# Altium schematic sheet CIRCUIT DIAGRAM.SchDoc
size A3; Date: 11/11/2025; Author: Hung Le; Revision: v1; SheetNumber: 3; SheetTotal: 3; Size: A3
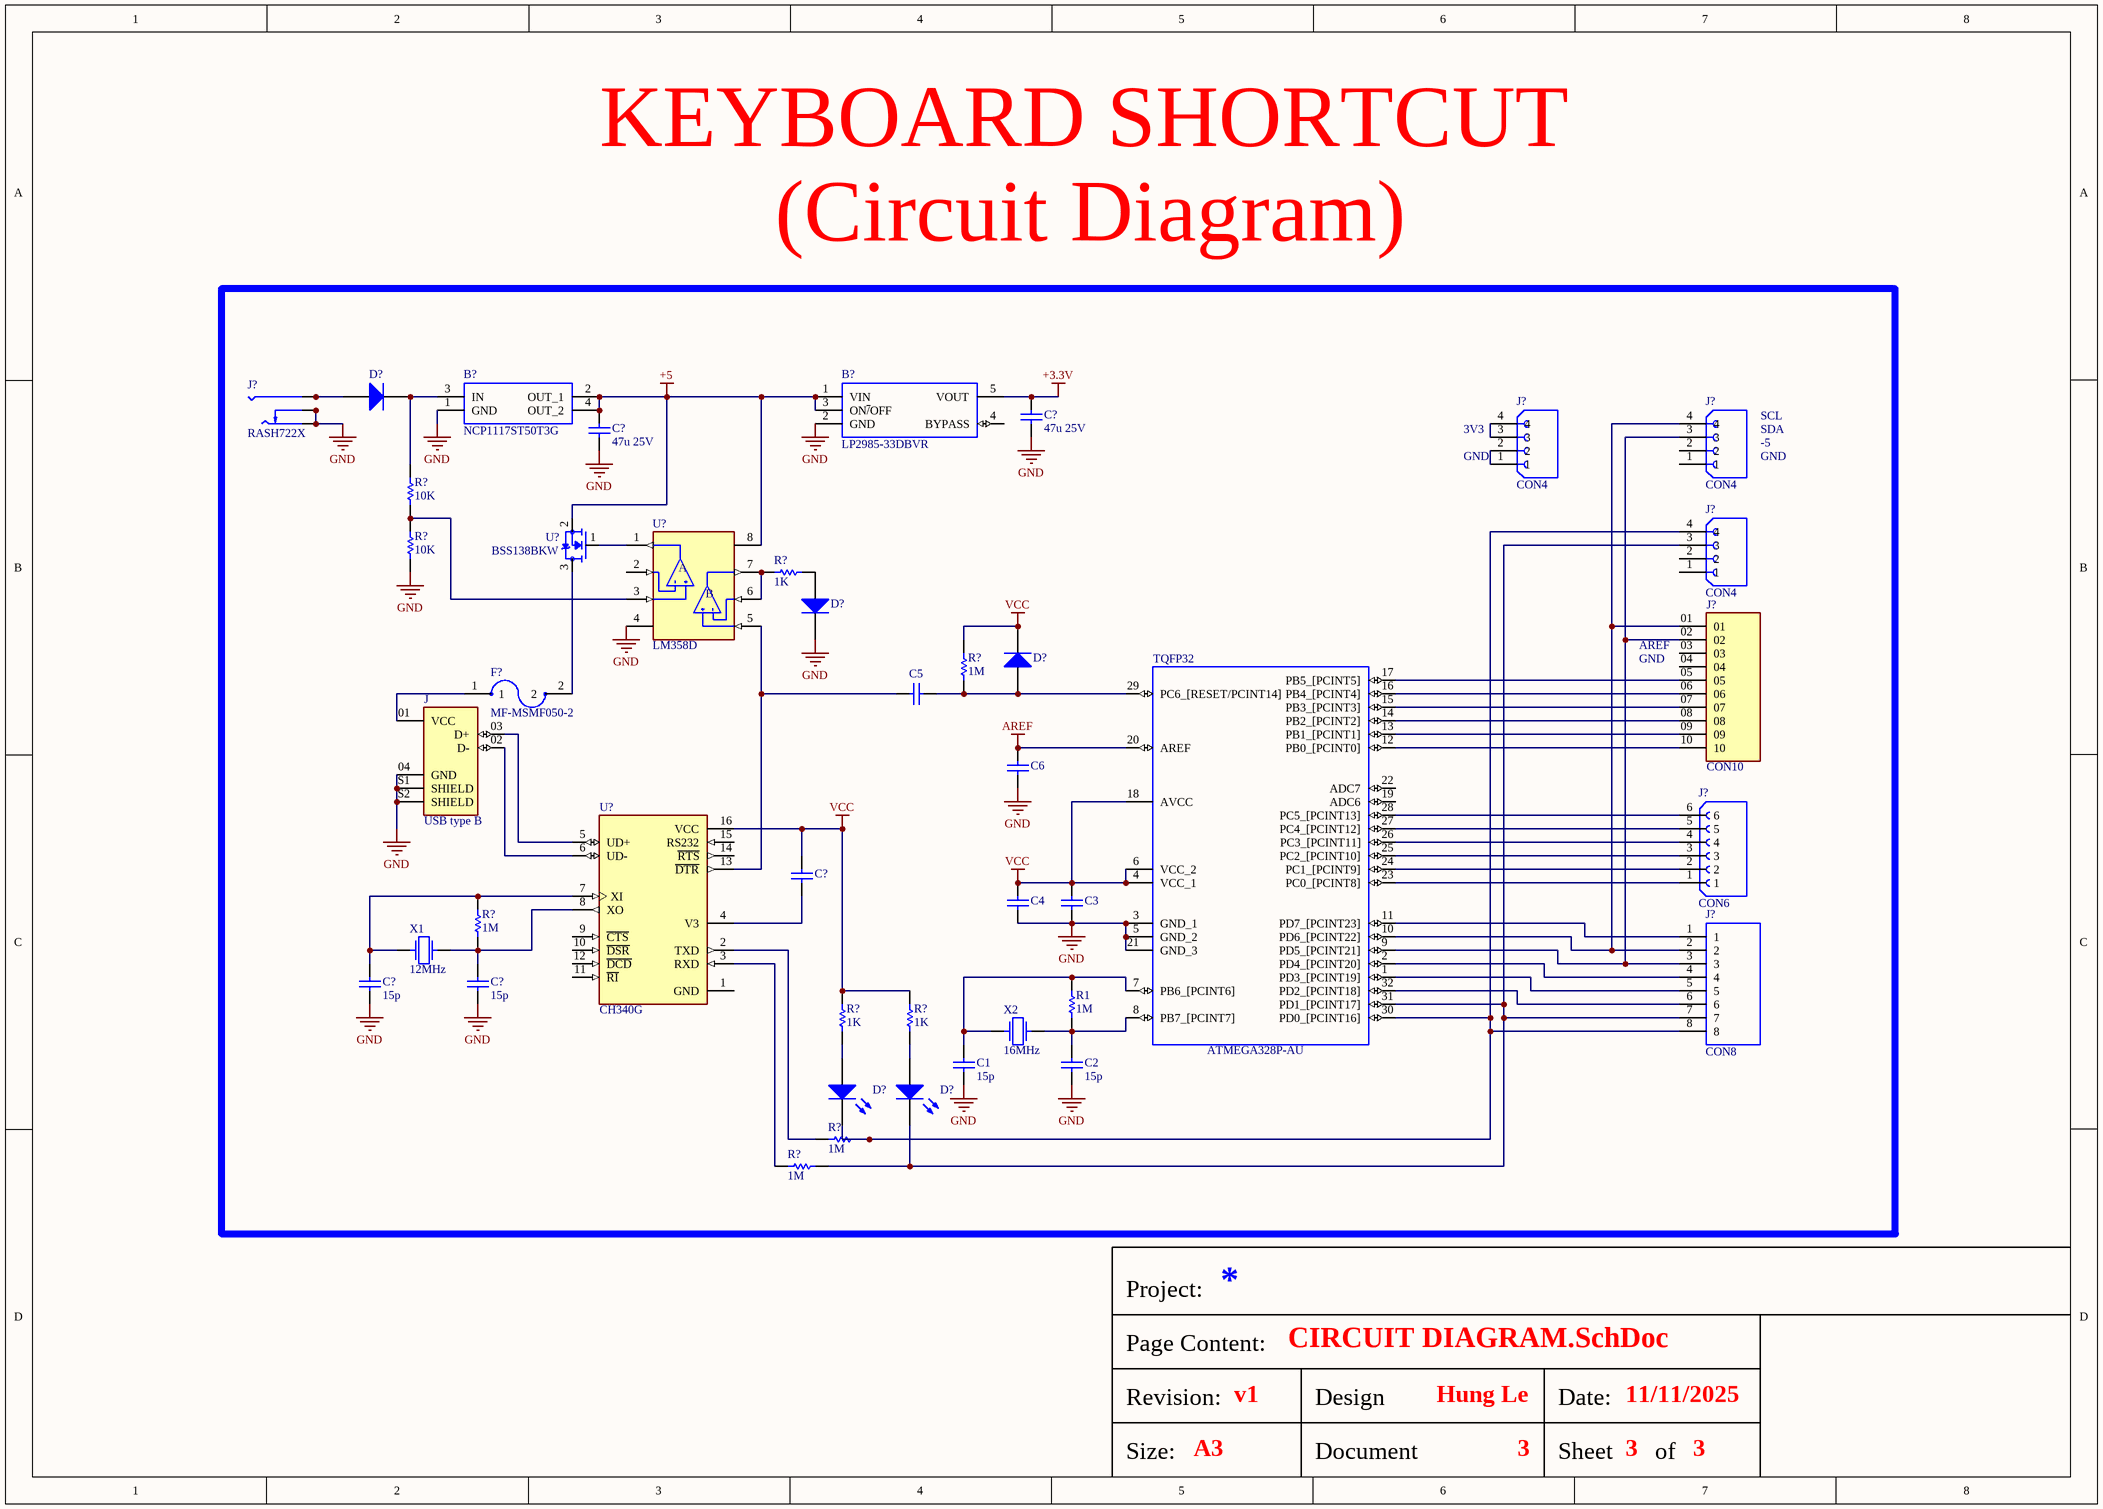
[diagram p0: CIRCUIT DIAGRAM.SchDoc]

## Parts
(Parts that share a designator on the sheet are numbered #1, #2 ... from top to bottom, then left to right.)
B?#1  LP2985-33DBVR  [SOT95P280X145-5N]
B?#2  NCP1117ST50T3G  [SOT230P700X180-4N]
C1  value 15p  (hidden comment: Capacitor)
C2  value 15p  (hidden comment: Capacitor)
C3  Capacitor  (value not drawn)
C4  Capacitor  (value not drawn)
C5  Capacitor  (value not drawn)
C6  Capacitor  (value not drawn)
C?#1  value 47u 25V  (hidden comment: Capacitor)
C?#2  value 47u 25V  (hidden comment: Capacitor)
C?#3  Capacitor  (value not drawn)
C?#4  value 15p  (hidden comment: Capacitor)
C?#5  value 15p  (hidden comment: Capacitor)
D?#1  Diode  (value not drawn)
D?#2  Diode  (value not drawn)
D?#3  Diode  (value not drawn)
D?#4  Light-Emitting Diode  (value not drawn)
D?#5  Light-Emitting Diode  (value not drawn)
F?  MF-MSMF050-2  [FUSM4632X85]
J  USB type B  [SAMTEC_USB-B-S-X-X-VT]
J?#1  RASH722X  [SWITCHCRAFT_RASH722X]
J?#2  CON4  [SULLINS_PPTC041LFBN-RC]
J?#3  CON4  [SULLINS_PPTC041LFBN-RC]
J?#4  CON4  [SULLINS_PPTC041LFBN-RC]
J?#5  CON10  [SAMTEC_SSW-110-01-XXX-S]
J?#6  CON6  [SULLINS_PPTC061LFBN-RC]
J?#7  CON8  [HDRV8W90P0X254_1X8_2032X249X560P]
R1  value 1M  (hidden comment: Resistor)
R?#1  value 10K  (hidden comment: Resistor)
R?#2  value 10K  (hidden comment: Resistor)
R?#3  value 1K  (hidden comment: Resistor)
R?#4  value 1M  (hidden comment: Resistor)
R?#5  value 1M  (hidden comment: Resistor)
R?#6  value 1K  (hidden comment: Resistor)
R?#7  value 1K  (hidden comment: Resistor)
R?#8  value 1M  (hidden comment: Resistor)
R?#9  value 1M  (hidden comment: Resistor)
TQFP32  ATMEGA328P-AU  [QFP80P900X900X120-32N]
U?#1  BSS138BKW  [SOT65P210X110-3N]
U?#2  LM358D  [SOIC127P599X175-8N]
U?#3  CH340G  [SOIC127P600X180-16N]
X1  F0: 12MHz  (hidden comment: Crystal)
X2  F0: 16MHz  (hidden comment: Crystal)

## Nets
+3.3V: B?#1.5(VOUT) C?#1.2
+5: B?#1.1(VIN) B?#1.3(ON~{/}OFF) B?#2.2(OUT_1) B?#2.4(OUT_2) C?#2.2 U?#1.2(S) U?#2.8(V+)
AREF: C6.2 TQFP32.20(AREF)
GND: B?#1.2(GND) B?#2.1(GND) C1.1 C2.1 C3.1 C4.1 C6.1 C?#1.1 C?#2.1 C?#4.1 C?#5.1 D?#2.2(K) J.04(GND) J.S1(SHIELD) J.S2(SHIELD) J?#1.SHUNT J?#1.SHUNT_2(SHUNT) J?#1.SLV(SLEEVE) J?#1.SLV_2(SLEEVE) R?#2.1 TQFP32.3(GND_1) TQFP32.5(GND_2) TQFP32.21(GND_3) U?#2.4(V-)
VCC: C3.2 C4.2 C?#3.2 D?#3.2(K) R?#4.2 R?#6.2 R?#7.2 TQFP32.4(VCC_1) TQFP32.6(VCC_2) TQFP32.18(AVCC) U?#3.16(VCC)
NetB?#2_3: B?#2.3(IN) D?#1.2(K) R?#1.2
NetC1_2: C1.2 R1.2 TQFP32.7(PB6_[PCINT6]) X2.2
NetC2_2: C2.2 R1.1 TQFP32.8(PB7_[PCINT7]) X2.1
NetC5_1: C5.1 D?#3.1(A) R?#4.1 TQFP32.29(PC6_[RESET/PCINT14])
NetC5_2: C5.2 U?#2.5(IN2+) U?#3.13(~{DTR})
NetC?#3_1: C?#3.1 U?#3.4(V3)
NetC?#4_2: C?#4.2 R?#5.2 U?#3.7(XI) X1.2
NetC?#5_2: C?#5.2 R?#5.1 U?#3.8(XO) X1.1
NetD?#1_1: D?#1.1(A) J?#1.PIN J?#1.PIN_2(PIN)
NetD?#2_1: D?#2.1(A) R?#3.1
NetD?#4_1: D?#4.1(A) R?#6.1
NetD?#4_2: D?#4.2(K) J?#4.4 J?#7.8 R?#8.1 TQFP32.30(PD0_[PCINT16])
NetD?#5_1: D?#5.1(A) R?#7.1
NetD?#5_2: D?#5.2(K) J?#4.3 J?#7.7 R?#9.1 TQFP32.31(PD1_[PCINT17])
NetF?_1: F?.1 J.01(VCC)
NetF?_2: F?.2 U?#1.3(D)
NetJ?#2_1: J?#2.1 J?#2.2
NetJ?#2_3: J?#2.3 J?#2.4
NetJ?#3_3: J?#3.3 J?#5.02 J?#7.3 TQFP32.9(PD5_[PCINT21])
NetJ?#3_4: J?#3.4 J?#5.01 J?#7.2 TQFP32.10(PD6_[PCINT22])
NetJ?#5_05: J?#5.05 TQFP32.17(PB5_[PCINT5])
NetJ?#5_06: J?#5.06 TQFP32.16(PB4_[PCINT4])
NetJ?#5_07: J?#5.07 TQFP32.15(PB3_[PCINT3])
NetJ?#5_08: J?#5.08 TQFP32.14(PB2_[PCINT2])
NetJ?#5_09: J?#5.09 TQFP32.13(PB1_[PCINT1])
NetJ?#5_10: J?#5.10 TQFP32.12(PB0_[PCINT0])
NetJ?#6_1: J?#6.1 TQFP32.23(PC0_[PCINT8])
NetJ?#6_2: J?#6.2 TQFP32.24(PC1_[PCINT9])
NetJ?#6_3: J?#6.3 TQFP32.25(PC2_[PCINT10])
NetJ?#6_4: J?#6.4 TQFP32.26(PC3_[PCINT11])
NetJ?#6_5: J?#6.5 TQFP32.27(PC4_[PCINT12])
NetJ?#6_6: J?#6.6 TQFP32.28(PC5_[PCINT13])
NetJ?#7_1: J?#7.1 TQFP32.11(PD7_[PCINT23])
NetJ?#7_4: J?#7.4 TQFP32.2(PD4_[PCINT20])
NetJ?#7_5: J?#7.5 TQFP32.1(PD3_[PCINT19])
NetJ?#7_6: J?#7.6 TQFP32.32(PD2_[PCINT18])
NetJ_02: J.02(D-) U?#3.6(UD-)
NetJ_03: J.03(D+) U?#3.5(UD+)
NetR?#1_1: R?#1.1 R?#2.2 U?#2.3(IN1+)
NetR?#3_2: R?#3.2 U?#2.6(IN2-) U?#2.7(OUT2)
NetR?#8_2: R?#8.2 U?#3.2(TXD)
NetR?#9_2: R?#9.2 U?#3.3(RXD)
NetU?#1_1: U?#1.1(G) U?#2.1(OUT1)

Not connected (* = marked no-connect by the designer): B?#1 4(BYPASS); J?#3 1 2; J?#4 1 2; J?#5 03 04; TQFP32 19(ADC6) 22(ADC7); U?#2 2(IN1-); U?#3 1(GND) 9(~{CTS}) 10(~{DSR}) 11(~{RI}) 12(~{DCD}) 14(~{RTS}) 15(RS232)

## Notes on the sheet
- KEYBOARD SHORTCUT
- (Circuit Diagram)
- ARDUINO UNO SMD CH340
- (near J?#2) 3V3
- SCL
- SDA
- -5
- (near J?#2) GND
- GND
- (near J?#5) AREF
- (near J?#5) GND
- Project:
- Page Content:
- Revision:
- Size:
- Design by:
- Document number:
- Date:
- Sheet       of
- (in symbol LM358D) A; B

## Library data of the parts
B?#1 = LP2985-33DBVR: 150-mA Low-noise Low-dropout Regulator With Shutdown; Manufacturer_Name: Texas Instruments; Geometry.Height: 1.45mm; Manufacturer_Part_Number: LP2985-33DBVR; RS Part Number: *; RS Price/Stock: *; Mouser Part Number: 595-LP2985-33DBVR; Mouser Price/Stock: https://www.mouser.com/Search/Refine.aspx?Keyword=595-LP2985-33DBVR; Datasheet Link: http://www.ti.com/lit/gpn/lp2985
B?#2 = NCP1117ST50T3G: ON SEMICONDUCTOR - NCP1117ST50T3G - LDO, REG, 20VIN, 1A, 5V, 1%, SOT223-3; Allied_Number: 70466898; Geometry.Height: 1.8mm; Manufacturer_Name: ON Semiconductor; Manufacturer_Part_Number: NCP1117ST50T3G; RS Part Number: 8022130P; RS Price/Stock: http://uk.rs-online.com/web/p/products/8022130P; Allied Price/Stock: http://www.alliedelec.com/on-semiconductor-ncp1117st50t3g/70466898/; Mouser Part Number: 863-NCP1117ST50T3G; Mouser Price/Stock: https://www.mouser.com/Search/Refine.aspx?Keyword=863-NCP1117ST50T3G; Datasheet Link: http://www.onsemi.com/pub/Collateral/NCP1117-D.PDF
C1 C2 C?#1 C?#2 C?#4 C?#5 = Capacitor: SimulationGenericComponent: True
C3-C6 C?#3 = Capacitor: SimulationGenericComponent: True; Value: 1p
D?#1-D?#3 = Diode: AF: 1; BV: 0; BV_MAX: 1e99; EG: 1.11; FC: 0.5; IBV: 0.001; ISR: 1e-14; MJSW: 0.33; NTUN: 30; TNOM: 27; XTI: 3; SimulationGenericComponent: True; CJO: 0; CJP: 0; CTA: 0; CTP: 0; FCS: 0.5; FV_MAX: 1e99; IKF: 0; IKR: 0; JSW: 0; JTUN: 0; JTUNSW: 0; KEG: 1; KF: 0; LEVEL: 1; N: 1; NBV: 1; NR: 1; NS: 1; PHP: 1; RS: 0; TCV: 0; TLEV: 0; TLEVC: 0; TM1: 0; TM2: 0; TPB: 0; TPHP: 0; TRS: 0; TRS2: 0; TT: 0; TTT1: 0; TTT2: 0; VJ: 1; XTITUN: 3; IS: 1e-14
D?#4 D?#5 = LED: AF: 1; BV: 0; BV_MAX: 1e99; EG: 1.11; FC: 0.5; IBV: 0.001; IS: 1e-14; MJSW: 0.33; NTUN: 30; TNOM: 27; XTI: 3; SimulationGenericComponent: True; CJO: 0; CJP: 0; CTA: 0; CTP: 0; FCS: 0.5; FV_MAX: 1e99; IKF: 0; IKR: 0; ISR: 1e-14; JSW: 0; JTUN: 0; JTUNSW: 0; KEG: 1; KF: 0; LEVEL: 1; N: 1; NBV: 1; NR: 1; NS: 1; PHP: 1; RS: 0; TCV: 0; TLEV: 0; TLEVC: 0; TM1: 0; TM2: 0; TPB: 0; TPHP: 0; TRS: 0; TRS2: 0; TT: 0; TTT1: 0; TTT2: 0; VJ: 1; XTITUN: 3
F? = MF-MSMF050-2: Polymeric PTC Resettable Fuse 15V 500 mA Ih Surface Mount 1812 (4532 Metric), Concave; MF: Bourns; MP: MF-MSMF050-2; Availability: In Stock; Check_prices: https://www.snapeda.com/parts/MF-MSMF050-2/Bourns+-+J.W.+Miller/view-part/?ref=eda; Price: None; Package: 1812 Bourns; Purchase-URL: https://pricing.snapeda.com/search/part/MF-MSMF050-2/?ref=eda; Value: *; SnapEDA_Link: https://www.snapeda.com/parts/MF-MSMF050-2/Bourns+-+J.W.+Miller/view-part/?ref=snap
J = USB-B-S-X-X-VT: USB-B (USB TYPE-B) USB 2.0 Receptacle Connector 4 Position Through Hole; MF: Samtec; MP: USB-B-S-F-B-VT; Value: *; SnapEDA_Link: https://www.snapeda.com/parts/USB-B-S-F-B-VT/Samtec%20Inc./view-part/937560/?ref=snap; Package: None; DigiKey-Purchase-URL: https://snapeda.com/shop?store=DigiKey&id=937560; Price: None; Availability: Unavailable; Toby_UK-Purchase-URL: https://snapeda.com/shop?store=Toby+UK&id=937560
J?#1 = RASH722X: Connector, Power, DC, HYBRID RA PWR JACK | Switchcraft RASH722X; SnapEDA_Link: https://www.snapeda.com/parts/RASH722X/SWITCHCRAFT/view-part/?ref=snap; Package: None; Value: *; MF: Switchcraft; MP: RASH722X; Check_prices: https://www.snapeda.com/parts/RASH722X/SWITCHCRAFT/view-part/?ref=eda
J?#2-J?#4 = PPTC041LFBN-RC: 4 Position Header Connector 0.100 (2.54mm) Through Hole Tin; MF: Sullins Connector; SnapEDA_Link: https://www.snapeda.com/parts/PPTC041LFBN-RC/Sullins/view-part/?ref=snap; Package: None; Value: *; MP: PPTC041LFBN-RC; Check_prices: https://www.snapeda.com/parts/PPTC041LFBN-RC/Sullins/view-part/?ref=eda
J?#5 = SSW-110-01-XXX-S: SSW - Samtec 2.54mm Single Row Straight Socket Strip 8.5 Profile - Fast Stock; MP: SSW-110-01-F-S; SnapEDA_Link: https://www.snapeda.com/parts/SSW-110-01-F-S/Samtec+Inc./view-part/?ref=snap; Package: None; Value: *; MF: Samtec; Check_prices: https://www.snapeda.com/parts/SSW-110-01-F-S/Samtec+Inc./view-part/?ref=eda
J?#6 = PPTC061LFBN-RC: 6 Position Total Single Row 2.54 mm Pitch Straight Female Header; MF: Sullins Connector Solutions; MP: PPTC061LFBNRC; SnapEDA_Link: https://www.snapeda.com/parts/PPTC061LFBNRC/Sullins/view-part/?ref=snap; Package: None; Value: *; Check_prices: https://www.snapeda.com/parts/PPTC061LFBNRC/Sullins/view-part/?ref=eda
J?#7 = 90120-0768: 8 way single row straight header Molex C-GRID III Series, Series Number 90120, 2.54mm Pitch 8 Way 1 Row Straight Pin Header, Through Hole; Allied_Number: 70372836; Geometry.Height: 5.6mm; Manufacturer_Name: Molex; Manufacturer_Part_Number: 90120-0768; RS Part Number: 1671900; RS Price/Stock: http://uk.rs-online.com/web/p/products/1671900; Allied Price/Stock: https://www.alliedelec.com/molex-incorporated-90120-0768/70372836/; Mouser Part Number: 538-90120-0768; Mouser Price/Stock: https://www.mouser.com/Search/Refine.aspx?Keyword=538-90120-0768; Datasheet Link: http://www.molex.com/molex/products/datasheet.jsp?part=active/0901200768_PCB_HEADERS.xml
R1 R?#1-R?#9 = Resistor: TC1: 0; SimulationGenericComponent: True; TC2: 0
TQFP32 = ATMEGA328P-AU: MICROCHIP - ATMEGA328P-AU. - MICROCONTROLLER MCU, 8 BIT, ATMEGA, 20MHZ, TQFP-32; Geometry.Height: 1.2mm; Manufacturer_Name: Microchip; Manufacturer_Part_Number: ATMEGA328P-AU; RS Part Number: 1310271; RS Price/Stock: http://uk.rs-online.com/web/p/products/1310271; Mouser Part Number: 556-ATMEGA328P-AU; Mouser Price/Stock: https://www.mouser.com/Search/Refine.aspx?Keyword=556-ATMEGA328P-AU; Datasheet Link: https://componentsearchengine.com/Datasheets/2/ATMEGA328P-AU.pdf
U?#1 = BSS138BKW: N-Channel 60V 320mA (Ta) 260mW (Ta), 830mW (Tc) Surface Mount SC-70; MF: NXP Semiconductors; SnapEDA_Link: https://www.snapeda.com/parts/BSS138BKW/NXP+Semiconductors/view-part/?ref=snap; Package: SOT-323 NXP Semiconductors; Value: *; MP: BSS138BKW; Check_prices: https://www.snapeda.com/parts/BSS138BKW/NXP+Semiconductors/view-part/?ref=eda
U?#2 = LM358D: Op Amp Dual Low Power Amplifier Â±15V/30V 8-Pin SO N Tube; MF: STMicroelectronics; SnapEDA_Link: https://www.snapeda.com/parts/LM358D/STMicroelectronics/view-part/?ref=snap; Package: None; Value: *; MP: LM358D; Check_prices: https://www.snapeda.com/parts/LM358D/STMicroelectronics/view-part/?ref=eda
U?#3 = CH340G: USB Interface Integrated Circuit; MF: WCH; Value: *; SnapEDA_Link: https://www.snapeda.com/parts/Ch340G/WCH/view-part/?ref=snap; MP: Ch340G; Check_prices: https://www.snapeda.com/parts/Ch340G/WCH/view-part/?ref=eda; Availability: Not in stock; Price: None; Package: None
X1 X2 = Crystal: R: 500; Q: 50K; SimulationGenericComponent: True